# Altium schematic sheet TSAL23-ESF-1.SchDoc
size A4
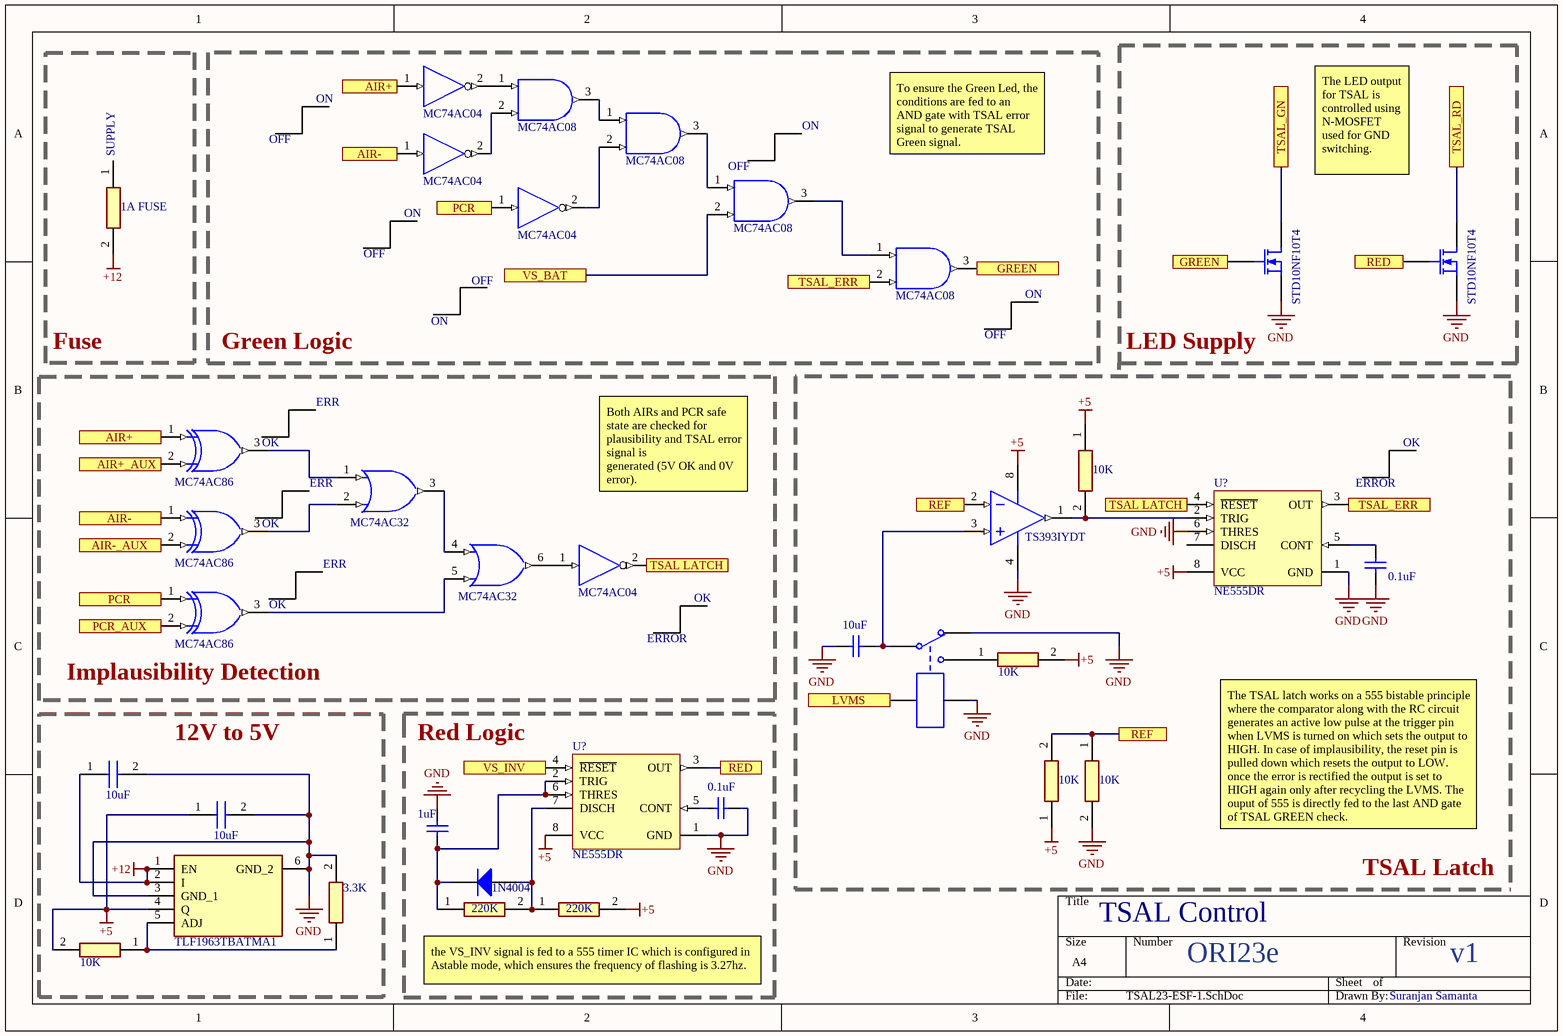
[diagram p0: TSAL23-ESF-1.SchDoc]

## Parts
(Parts that share a designator on the sheet are numbered #1, #2 ... from top to bottom, then left to right.)
C?#1  0.1uF  [RAD-0.3]
C?#2  10uF  [RAD-0.3]
C?#3  10uF  [CAPC3225X230N]
C?#4  10uF  [CAPC3225X230N]
C?#5  0.1uF  [RAD-0.3]
C?#6  1uF  [RAD-0.3]
D?  1N4004  [DIOD-DO-41-P-2_V2]
K?  Relay-SPDT  [MODULE5B]  (value not drawn)
LDO?  TLF1963TBATMA1  [TLS850B0TBV33ATMA1]
Q?#1  STD10NF10T4  [E3]
Q?#2  STD10NF10T4  [E3]
R?#1  1A FUSE  [RESC0603X28N]
R?#2  10K  [RESC3126X60N]
R?#3  10K  [RESC3126X60N]
R?#4  10K  [RESC3126X60N]
R?#5  10K  [RESC3126X60N]
R?#6  220K  [RESC3126X60N]
R?#7  220K  [RESC3126X60N]
R?#8  10K  [RESC3126X60N]
R?#9  3.3K  [RESC3126X60N]
U?#1  MC74AC04  [N0014A]  (part A of 7)
U?#2  MC74AC08  [PW0014A_N]  (part A of 5)
U?#3  MC74AC08  [PW0014A_N]  (part A of 5)
U?#4  MC74AC04  [N0014A]  (part A of 7)
U?#5  MC74AC08  [PW0014A_N]  (part A of 5)
U?#6  MC74AC04  [N0014A]  (part A of 7)
U?#7  MC74AC08  [PW0014A_N]  (part A of 5)
U?#8  MC74AC86  [N0014A]  (part A of 5)
U?#9  MC74AC32  [N0014A]  (part A of 5)
U?#10  TS393IYDT  [STM-SO-8_D_L]  (part A of 2)
U?#11  NE555DR  [D0008A_M]
U?#12  MC74AC86  [N0014A]  (part A of 5)
U?#13  MC74AC32  [N0014A]  (part B of 5)
U?#14  MC74AC04  [N0014A]  (part A of 7)
U?#15  MC74AC86  [N0014A]  (part A of 5)
U?#16  NE555DR  [D0008A_M]

## Blocks framed on the sheet
Fuse: R?#1
Green Logic: U?#1-U?#7
Implausibility Detection: U?#8 U?#9 U?#12-U?#15
12V to 5V: C?#3 C?#4 LDO? R?#8 R?#9
Red Logic: C?#5 C?#6 D? R?#6 R?#7 U?#16

## Ports
AIR+, AIR+_AUX, AIR-, AIR-_AUX, GREEN, LVMS, PCR, PCR_AUX, RED, REF, TSAL LATCH, TSAL_ERR, TSAL_GN, TSAL_RD, VS_BAT, VS_INV

## Nets
+5: C?#4.1 LDO?.4(Q) R?#2.1 R?#3.2 R?#5.1 R?#7.2 R?#8.2 U?#10.8(VCC+) U?#11.8(VCC) U?#16.8(VCC)
+12: C?#3.1 LDO?.1(EN) LDO?.2(I) R?#1.2
GND: C?#1.2 C?#2.2 C?#3.2 C?#4.2 C?#5.1 C?#6.2 K?.2 K?.5 LDO?.3(GND_1) LDO?.6(GND_2) Q?#1.3(S) Q?#2.3(S) R?#4.2 R?#9.2 U?#10.4(VCC-) U?#11.1(GND) U?#11.6(THRES) U?#16.1(GND)
AIR+: U?#1.1(1A) U?#8.1(1A) ; port AIR+
AIR+_AUX: U?#8.2(1B) ; port AIR+_AUX
AIR-: U?#4.1(1A) U?#12.1(1A) ; port AIR-
AIR-_AUX: U?#12.2(1B) ; port AIR-_AUX
GREEN: Q?#1.2(G) U?#7.3(1Y) ; port GREEN
LVMS: K?.4 ; port LVMS
PCR: U?#6.1(1A) U?#15.1(1A) ; port PCR
PCR_AUX: U?#15.2(1B) ; port PCR_AUX
RED: Q?#2.2(G) U?#16.3(OUT) ; port RED
REF: R?#4.1 R?#5.2 U?#10.2(IN1-) ; port REF
TSAL LATCH: U?#11.4(~{RESET}) U?#14.2(~{1Y}) ; port TSAL LATCH
TSAL_ERR: U?#7.2(1B) U?#11.3(OUT) ; port TSAL_ERR
TSAL_GN: Q?#1.1(D) ; port TSAL_GN
TSAL_RD: Q?#2.1(D) ; port TSAL_RD
VS_BAT: U?#5.2(1B) ; port VS_BAT
VS_INV: U?#16.4(~{RESET}) ; port VS_INV
NetC?#1_1: C?#1.1 U?#11.5(CONT)
NetC?#2_1: C?#2.1 K?.1 U?#10.3(IN1+)
NetC?#5_2: C?#5.2 U?#16.5(CONT)
NetC?#6_1: C?#6.1 D?.2(K) R?#6.1 U?#16.2(TRIG) U?#16.6(THRES)
NetD?_1: D?.1(A) R?#6.2 R?#7.1 U?#16.7(DISCH)
NetK?_3: K?.3 R?#3.1
NetLDO?_5: LDO?.5(ADJ) R?#8.1 R?#9.1
NetR?#2_2: R?#2.2 U?#10.1(OUT1) U?#11.2(TRIG)
NetU?#1_2: U?#1.2(~{1Y}) U?#2.1(1A)
NetU?#2_2: U?#2.2(1B) U?#4.2(~{1Y})
NetU?#2_3: U?#2.3(1Y) U?#3.1(1A)
NetU?#3_2: U?#3.2(1B) U?#6.2(~{1Y})
NetU?#3_3: U?#3.3(1Y) U?#5.1(1A)
NetU?#5_3: U?#5.3(1Y) U?#7.1(1A)
NetU?#8_3: U?#8.3(1Y) U?#9.1(1A)
NetU?#9_2: U?#9.2(1B) U?#12.3(1Y)
NetU?#9_3: U?#9.3(1Y) U?#13.4(2A)
NetU?#13_5: U?#13.5(2B) U?#15.3(1Y)
NetU?#13_6: U?#13.6(2Y) U?#14.1(1A)

Not connected (* = marked no-connect by the designer): R?#1 1; U?#11 7(DISCH)

## Notes on the sheet
- ON
- (near R?#1) SUPPLY
- OFF
- (near U?#5) OFF
- To ensure the Green Led, the  conditions are fed to an AND gate with TSAL error
  signal to generate TSAL Green signal.
- The LED output for TSAL is controlled using N-MOSFET used for GND switching.
- LED Supply
- (near U?#8) OK
- ERR
- OK
- (near U?#9) ERR
- Both AIRs and PCR safe state are checked for plausibility and TSAL error signal is
  generated (5V OK and 0V error).
- (near U?#11) ERROR
- (near U?#12) OK
- (near U?#15) OK
- ERROR
- The TSAL latch works on a 555 bistable principle where the comparator along with the RC circuit generates an active low pulse at the trigger pin when LVMS is turned on which sets the output to HIGH. In case of implausibility, the reset pin is pulled down which resets the output to LOW. once the error is rectified the output is set to HIGH again only after recycling the LVMS. The ouput of 555 is directly fed to the last AND gate of TSAL GREEN check.
- TSAL Control
- TSAL Latch
- (near R?#6) the VS_INV signal is fed to a 555 timer IC which is configured in Astable mode, which ensures the frequency of flashing is 3.27hz.
- ORI23e
- v1
- Suranjan Samanta

## Library data of the parts
C?#1 C?#2 C?#5 C?#6 = Cap: Capacitor; Value: 100pF; Published: 8-Jun-2000; LatestRevisionDate: 17-Jul-2002; LatestRevisionNote: Re-released for DXP Platform.; PackageReference: RAD-0.3; Publisher: Altium Limited; PackageDescription: Radial Cap, Thru-Hole; 2 Leads; 0.3 in Pin Spacing
C?#3 C?#4 = C3225X7R1N106K250AC: Capacitor; Manufacturer_Name: TDK; Datasheet Link: https://componentsearchengine.com/Datasheets/1/C3225X7R1N106K250AC.pdf; Height: 2.3mm; Mouser2 Part Number: 810-C3225X7R1N106K25; Mouser2 Price/Stock: https://www.mouser.com/Search/Refine.aspx?Keyword=810-C3225X7R1N106K25; Manufacturer_Part_Number: C3225X7R1N106K250AC
D? = CMP-0639-00014-2: 1.0 A Rectifier, 15 pF, 400 V, -65 to 150 degC, 2-Pin DO-41 Plastic, RoHS, Tape and Reel; PartNumber: 1N4004-T; Manufacturer: Diodes Inc; VF (V): 1; Max. IR (uA): 5; Max. IFSM (A): 30; VRRM (V): 400; CT (pF): 15; ComponentLink2Description: Datasheet; PackageReference: DO-41-P-2; Packing: Tape and Reel; DatasheetVersion: Rev. 8-2; Operating Temperature Range (degC): -65 to 150; ComponentLink2URL: http://diodes.com/datasheets/ds28002.pdf; PackageDescription: 2-Pin Axial Lead, Body 4.635 x 2.36 mm, Lead Spread 25.4 mm; ComponentLink1Description: Manufacturer URL; Mounting Technology: Through Hole; Max. Average Rectified Current IO (A): 1; RoHS: TRUE; ComponentLink1URL: http://diodes.com/
K? = Relay-SPDT: Single-Pole Dual-Throw Relay; Published: 24-Mar-1999; LatestRevisionDate: 17-Jul-2002; LatestRevisionNote: Re-released for DXP Platform.; PackageReference: MODULE5B; Publisher: Altium Limited
LDO? = TLF1963TBATMA1: Integrated Circuit; Manufacturer_Name: Infineon; Datasheet Link: https://www.infineon.com/dgdl/Infineon-TLF1963-DS-v01_00-EN.pdf?fileId=5546d46258fc0bc1015969d2981941e0; Height: 4.4mm; Manufacturer_Part_Number: TLF1963TBATMA1; Mouser Part Number: 726-TLF1963TBATMA1; Mouser Price/Stock: https://www.mouser.com/Search/Refine.aspx?Keyword=726-TLF1963TBATMA1
Q?#1 Q?#2 = MOSFET-N: N-Channel MOSFET; Published: 8-Jun-2000; LatestRevisionDate: 17-Jul-2002; LatestRevisionNote: Re-released for DXP Platform.; PackageVersion: 1995/1996; PackageReference: E3; Publisher: Altium Limited; PackageDescription: TO, Flat Index; 3 In-Line, Axial Leads; Body Dia. 4.6mm; Lead Dia. 0.5 mm (max)
R?#1 = CPF0201D100RE1: Resistor; Manufacturer_Name: TE Connectivity; Datasheet Link: http://www.te.com/commerce/DocumentDelivery/DDEController?Action=showdoc&DocId=Data+Sheet%7F1773200-1%7FA%7Fpdf%7FEnglish%7FENG_DS_1773200-1_A.pdf%7F4-2176215-6; Height: 0.28mm; Manufacturer_Part_Number: CPF0201D100RE1; Mouser Part Number: 279-CPF0201D100RE1; Mouser Price/Stock: https://www.mouser.com/Search/Refine.aspx?Keyword=279-CPF0201D100RE1; RS Part Number: 7549192; RS Price/Stock: http://uk.rs-online.com/web/p/products/7549192
R?#2-R?#9 = RC1210JR-0710KL: Resistor; Manufacturer_Name: YAGEO (PHYCOMP); Datasheet Link: http://www.yageo.com/documents/recent/PYu-RC1210_51_RoHS_L_(4).pdf; Height: 0.6mm; Manufacturer_Part_Number: RC1210JR-0710KL; Mouser Part Number: 603-RC1210JR-0710KL; Mouser Price/Stock: https://www.mouser.com/Search/Refine.aspx?Keyword=603-RC1210JR-0710KL
U?#1 U?#4 U?#6 U?#14 = CMP-1615-00872-2: Hex inverters, N0014A, TUBE; Generic Part Number: SN7404; Manufacturer: Texas Instruments; Voltage(Nom)(V): 5; Bits(#): 6; tpd @ Nom Voltage(Max)(ns): 22; Schmitt Trigger: No; VCC(Max)(V): 5.25; ICC @ Nom Voltage(Max)(mA): 0.033; Technology Family: TTL; Rating: Catalog; F @ Nom Voltage(Max)(Mhz): 35; Output Type: CMOS; VCC(Min)(V): 4.75; Output Drive (IOL/IOH)(Max)(mA): -0.4/16; DatasheetVersion: SDLS029C; Code_JEDEC: MS-001; Operating Temperature Range(C): 0 to 70; PackageReference: N0014A; Input Type: TTL
U?#2 U?#3 U?#5 U?#7 = CMP-0777-00390-3: Quadruple 2-Input Positive-AND Gates, PW0014A, LARGE T&R; Generic Part Number: SN74AHCT08; Manufacturer: Texas Instruments; Output Type: CMOS; VCC(Min)(V): 4.5; Technology Family: AHCT; tpd @ Nom Voltage(Max)(ns): 8; Bits(#): 4; Input Type: TTL; Schmitt Trigger: No; Voltage(Nom)(V): 5; VCC(Max)(V): 5.5; Output Drive (IOL/IOH)(Max)(mA): -8/8; Rating: Catalog; ICC @ Nom Voltage(Max)(mA): 0.02; F @ Nom Voltage(Max)(Mhz): 70; DatasheetVersion: SCLS237M; Operating Temperature Range(C): -40 to 125,-40 to 85; PackageReference: PW0014A
U?#8 U?#12 U?#15 = CMP-0778-00104-3: High Speed CMOS Logic Quad 2-Input Exclusive-OR Gates, N0014A, TUBE; Manufacturer: Texas Instruments; Generic Part Number: CD74HC86; tpd @ Nom Voltage(Max)(ns): 30; Rating: Catalog; F @ Nom Voltage(Max)(Mhz): 70; VCC(Max)(V): 6; ICC @ Nom Voltage(Max)(mA): 0.02; VCC(Min)(V): 2; Voltage(Nom)(V): 5; Technology Family: HC; Schmitt Trigger: No; Output Drive (IOL/IOH)(Max)(mA): 5.2/-5.2; Bits(#): 4; Output Type: CMOS; DatasheetVersion: SCHS137D; Input Type: CMOS; PackageReference: N0014A; Operating Temperature Range(C): -55 to 125
U?#9 U?#13 = CMP-1573-00140-3: Quad 2-input positive-OR gates, N0014A, TUBE; Manufacturer: Texas Instruments; Generic Part Number: SN7432; VCC(Max)(V): 5.25; Voltage(Nom)(V): 5; VCC(Min)(V): 4.75; F @ Nom Voltage(Max)(Mhz): 100; Output Type: TTL; Output Drive (IOL/IOH)(Max)(mA): 0.8/-16; ICC @ Nom Voltage(Max)(mA): 0.038; Bits(#): 4; tpd @ Nom Voltage(Max)(ns): 22; Rating: Catalog; PackageVersion: http://www.ti.com/lit/ml/mpdi002c/mpdi002c.pdf; Operating Temperature Range(C): 0 to 70; DatasheetVersion: SDLS100; Code_JEDEC: MS-001; Input Type: TTL; PackageReference: N0014A
U?#10 = CMP-2000-06550-1: Low-Power, Dual-Voltage Comparator, 2 to 36 V, 0 to 70 degC, 8-Pin SOIC (SO), RoHS, Tape and Reel; Manufacturer: STMicroelectronics; Voltage - Supply, Single/Dual (±): 2V~36V,±1V~18V; Current - Input Bias (Max): 0.25µA@5V; Number of Elements: 2; Current - Output (Typ): 18mA@5V; Other Names: 497-1593-2; Voltage - Input Offset (Max): 5mV@30V; Output Type: CMOS,DTL,ECL,MOS,Open-Collector,TTL; EDA / CAD Models: DownloadfromAcceleratedDesigns; Other Related Documents: LM393ViewAllSpecificationsLM393ViewAllSpecifications; Online Catalog: Comparators-2elements; Current - Quiescent (Max): 2.5mA; Standard Package: 2,500; Manufacturer URL: http://www.st.com/; Package Description: 8-Pin Small Outline Integrated Circuit, Body 4.9 x 3.9 mm, Pitch 1.27 mm; Packaging: Tape&Reel(TR); Datasheet Version: Rev. 15, 02/2016; Category: IntegratedCircuits(ICs); Operating Temperature: 0°C~70°C; Mounting Type: SurfaceMount; Supplier Device Package: 8-SO; Datasheet URL: http://www.st.com/content/ccc/resource/technical/document/datasheet/group1/b4/cc/cf/13/18/28/44/f5/CD00000465/files/CD00000465.pdf/jcr:content/translations/en.CD00000465.pdf; Family: Linear-Comparators; Mounting Technology: SurfaceMount; Type: GeneralPurpose; Package Reference: SO-8; Package / Case: 8-SOIC(0.154",3.90mmWidth)
U?#11 U?#16 = CMP-1685-00007-1: Precision Timer, 4.5 to 16 V, 0 to 70 degC, 8-Pin SOIC (D8), Green (RoHS & no Sb/Br), Tape and Reel; Forward Voltage: 450 mV; Forward Current: 1 A; Max Surge Current: 30 A; Peak Reverse Current: 500 uA; Case\Package: SMA; PackageReference: D0008A; Width: 2.84 mm; PackageDescription: 8-Pin Small Outline Integrated Circuit, Body 4.9 x 3.9 mm, Pitch 1.27 mm; DatasheetVersion: SLFS022I, 09/2014; ComponentLink2Description: Datasheet; Package Quantity: 1; REACH SVHC: Unknown; Radiation Hardening: No; Height: 2.44 mm; Code_JEDEC: MS-012; Pins: 2; ComponentLink1Description: Manufacturer URL; ComponentLink3Description: Package Specification; ComponentLink3URL: http://www.ti.com/lit/ml/msoi002j/msoi002j.pdf; Length: 4.57 mm; ComponentLink1URL: http://www.ti.com/; Mount: Surface Mount; PackageVersion: 4040047-3/M, 06/2011; ComponentLink2URL: http://www.ti.com/general/docs/lit/getliterature.tsp?genericPartNumber=NE555&fileType=pdf; RoHSCompliant: true; Max Operating Temperature: 125 degC; Packaging: Cut Tape; Min Operating Temperature: -55 degC